# EAGLE design wifi-power (EAGLE 7.4.0)
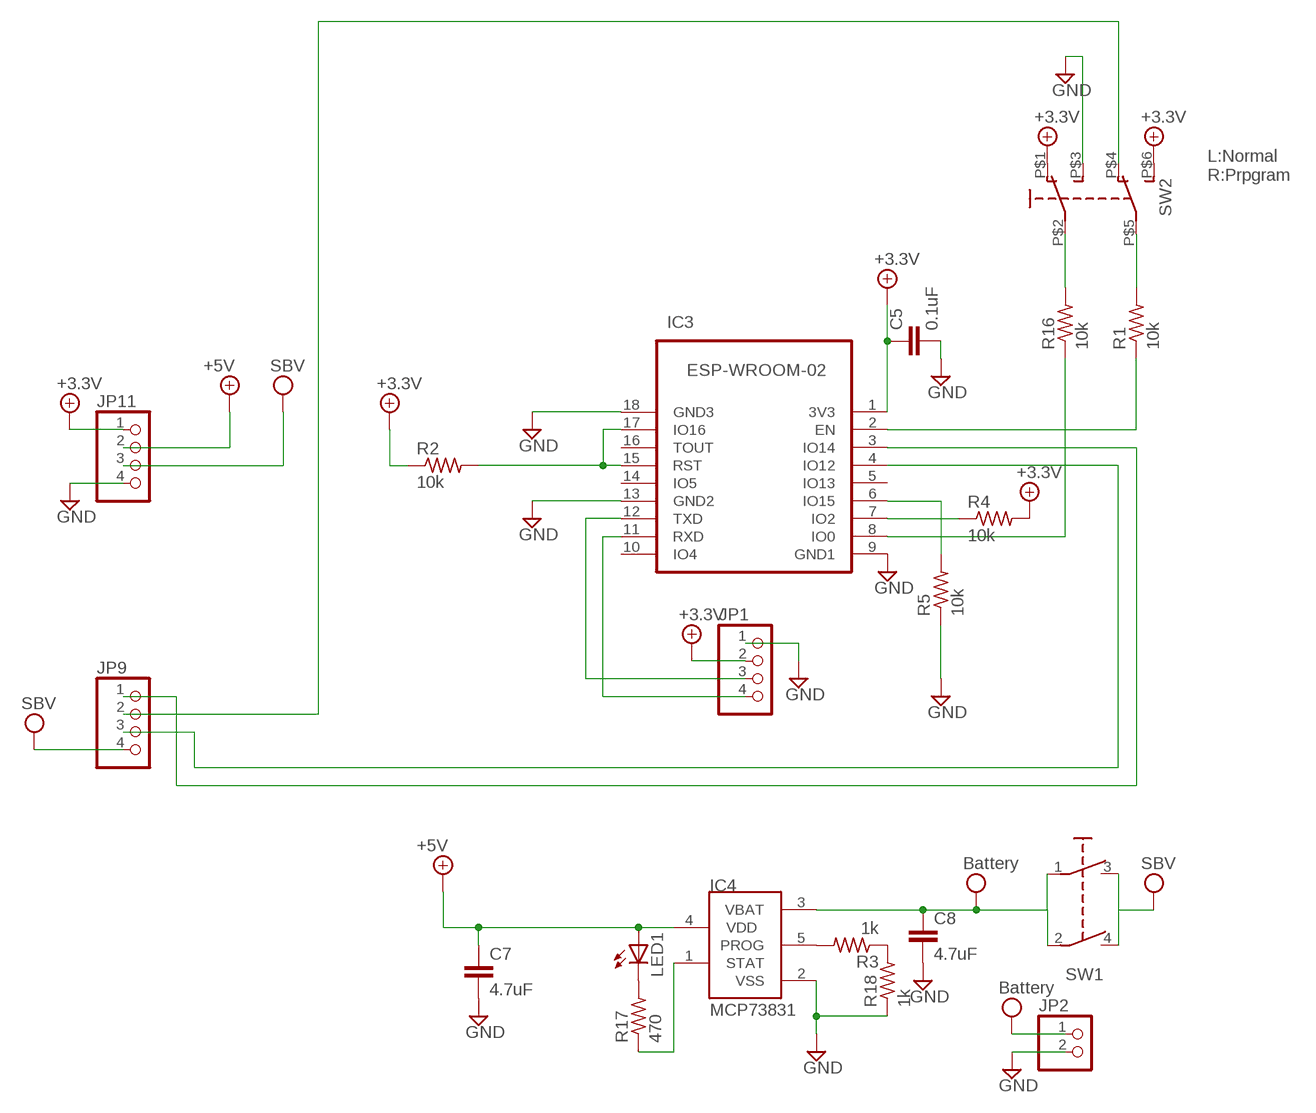
[diagram p0: schematic, sheet 1]

## Parts
C5  0.1uF  C-EUC0603K  [C0603K]
C7  4.7uF  C-EUC0603K  [C0603K]
C8  4.7uF  C-EUC0603K  [C0603K]
IC3  ESP-WROOM-02  ESP-WROOM-02FRONT-FACE  [FRONT-FACE]
IC4  MCP73831  [SOT23-5L]
JP1  PINHD-1X4  [1X04]
JP2  PINHD-1X2  [1X02]
JP9  PINHD-1X4  [1X04]
JP11  PINHD-1X4  [1X04]
LED1  LG_T679-E1F1-1  [PLCC2]
R1  10k  R-US_M0805  [M0805]
R2  10k  R-US_M0805  [M0805]
R3  1k  R-US_MELF0102R  [MINI_MELF-0102R]
R4  10k  R-US_M0805  [M0805]
R5  10k  R-US_M0805  [M0805]
R16  10k  R-US_M0805  [M0805]
R17  470  R-US_M0805  [M0805]
R18  1k  R-US_MELF0102R  [MINI_MELF-0102R]
SW1  2X1S-SIDE-0.1INCH  [2X1SIDE-0.1INCH]
SW2  MSS-22C02  [MSS-22C02]

## Nets
+3.3V: C5.1 IC3.1(3V3) JP1.2 JP11.1 R2.1 R4.2 SW2.P$1(O) SW2.P$6(S1)
+5V/2: C7.1 IC4.4(VDD) JP11.2 LED1.A ; supply symbol labelled +5V
GND: C5.2 C7.2 C8.2 IC3.9(GND1) IC3.13(GND2) IC3.18(GND3) IC4.2(VSS) JP1.1 JP2.2 JP11.4 R5.1 R18.1 SW2.P$3(S)
N$2: IC3.11(RXD) JP1.4
N$3: IC3.12(TXD) JP1.3
N$4: IC3.2(EN) R1.1
N$5: IC3.15(RST) IC3.17(IO16) R2.2
N$6: IC3.7(IO2) R4.1
N$7: IC3.8(IO0) R16.1
N$8: IC3.6(IO15) R5.2
N$9: IC4.5(PROG) R3.2
N$10: R3.1 R18.2
N$11: IC3.4(IO12) JP9.3
N$16: LED1.C R17.2
N$19: JP9.2 SW2.P$4(O1)
N$20: IC4.1(STAT) R17.1
N$49: R16.2 SW2.P$2(P)
N$56: R1.2 SW2.P$5(P1)
N$58: IC3.3(IO14) JP9.1
VCC: C8.1 IC4.3(VBAT) JP2.1 SW1.1(P) SW1.2(P1) ; supply symbol labelled Battery
VPP: JP9.4 JP11.3 SW1.3(S) SW1.4(S1) ; supply symbol labelled SBV
Unconnected: IC3.5(IO13) IC3.10(IO4) IC3.14(IO5) IC3.16(TOUT)

## Notes on the sheet
- L:Normal
  R:Prpgram

## Library data of the parts
C5 C7 C8 = rcl:C-EU: CAPACITOR, European symbol
IC3 = esp-wroom-02:ESP-WROOM-02: WiFi module - ESP-WROOM-02
IC4 = microchip-update-2:MCP73831: Miniature Single-Cell, Fully Integrated Li-Ion, Li-Polymer Charge Management Controllers
JP1 JP9 JP11 = pinhead:PINHD-1X4: PIN HEADER
JP2 = pinhead:PINHD-1X2: PIN HEADER
LED1 = led:*_T679-?-1: LC TOPLED® Low Current LED Source: http://catalog.osram-os.com .. LG_LS_LY_T679_OBS.pdf; COLOR: green
R1-R5 R16-R18 = rcl:R-US_: RESISTOR, American symbol
SW1 = switch-custom:2X1S-SIDE-0.1INCH
SW2 = switch-custom:MSS-22C02: See-Plus MSS-22C02 2回路2接点 超小型スライドスイッチ http://www.sengoku.co.jp/mod/sgk_cart/detail.php?code=EEHD-4J3U#

## Board
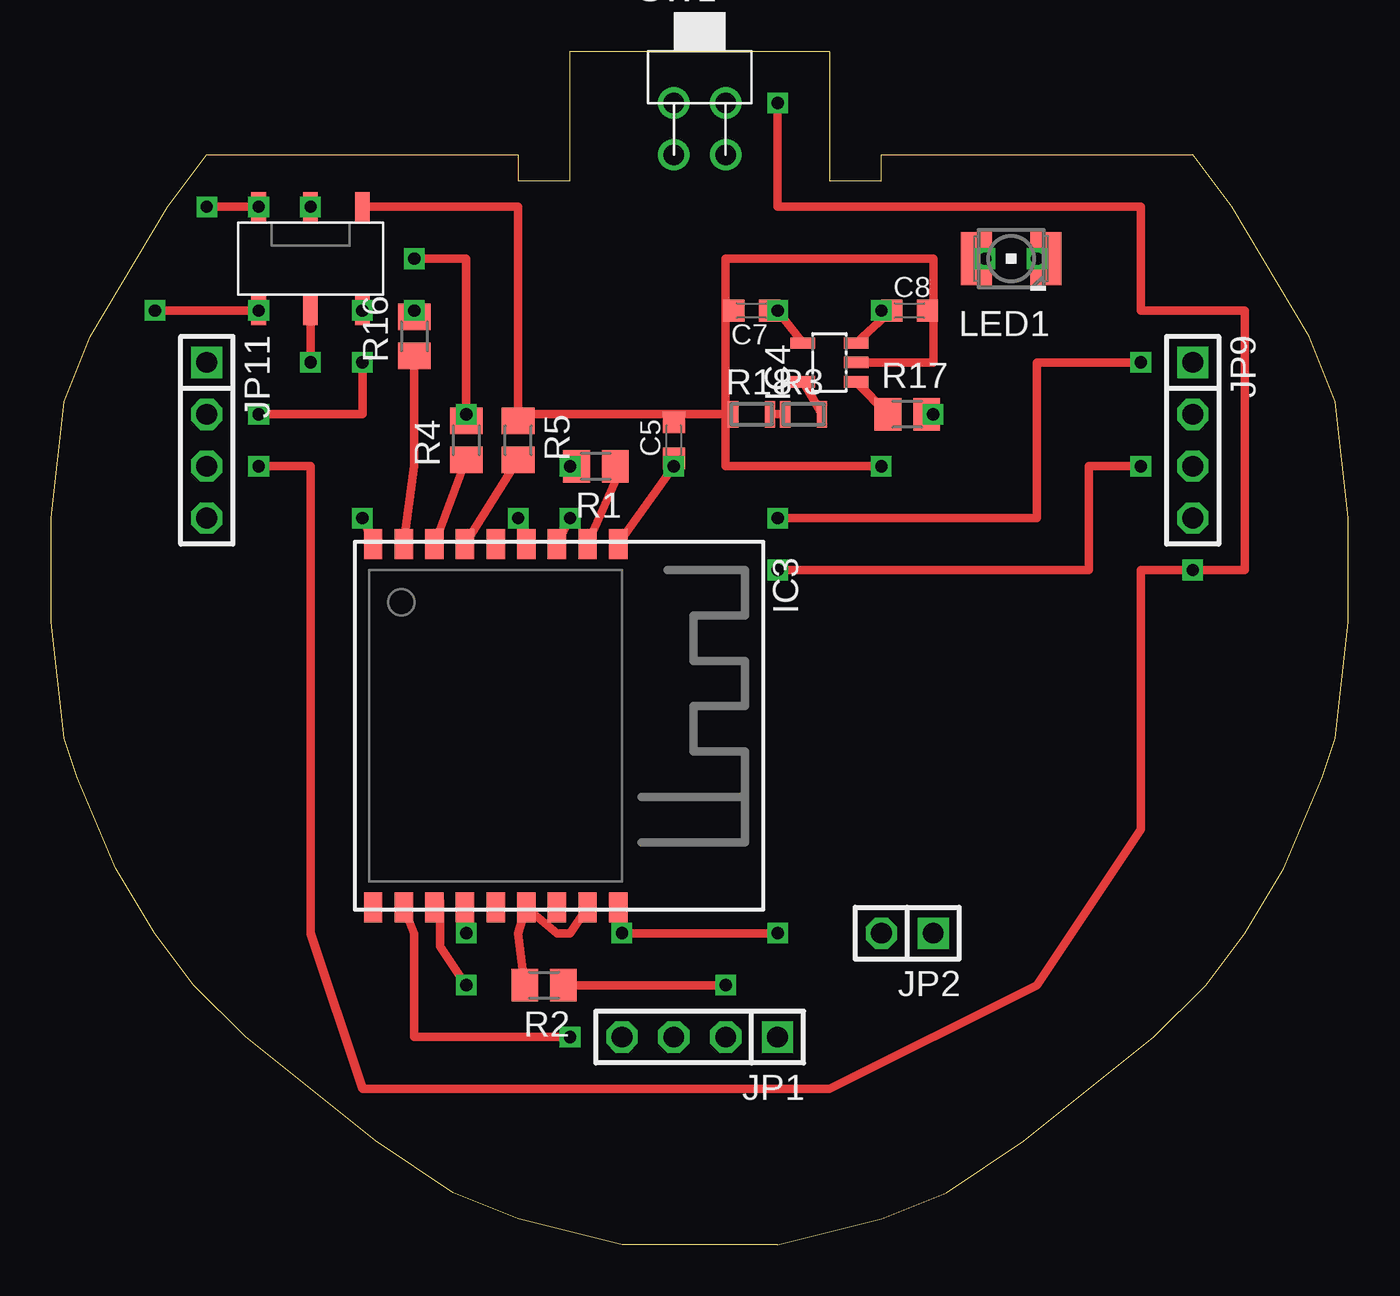
[diagram p1: board, top side]
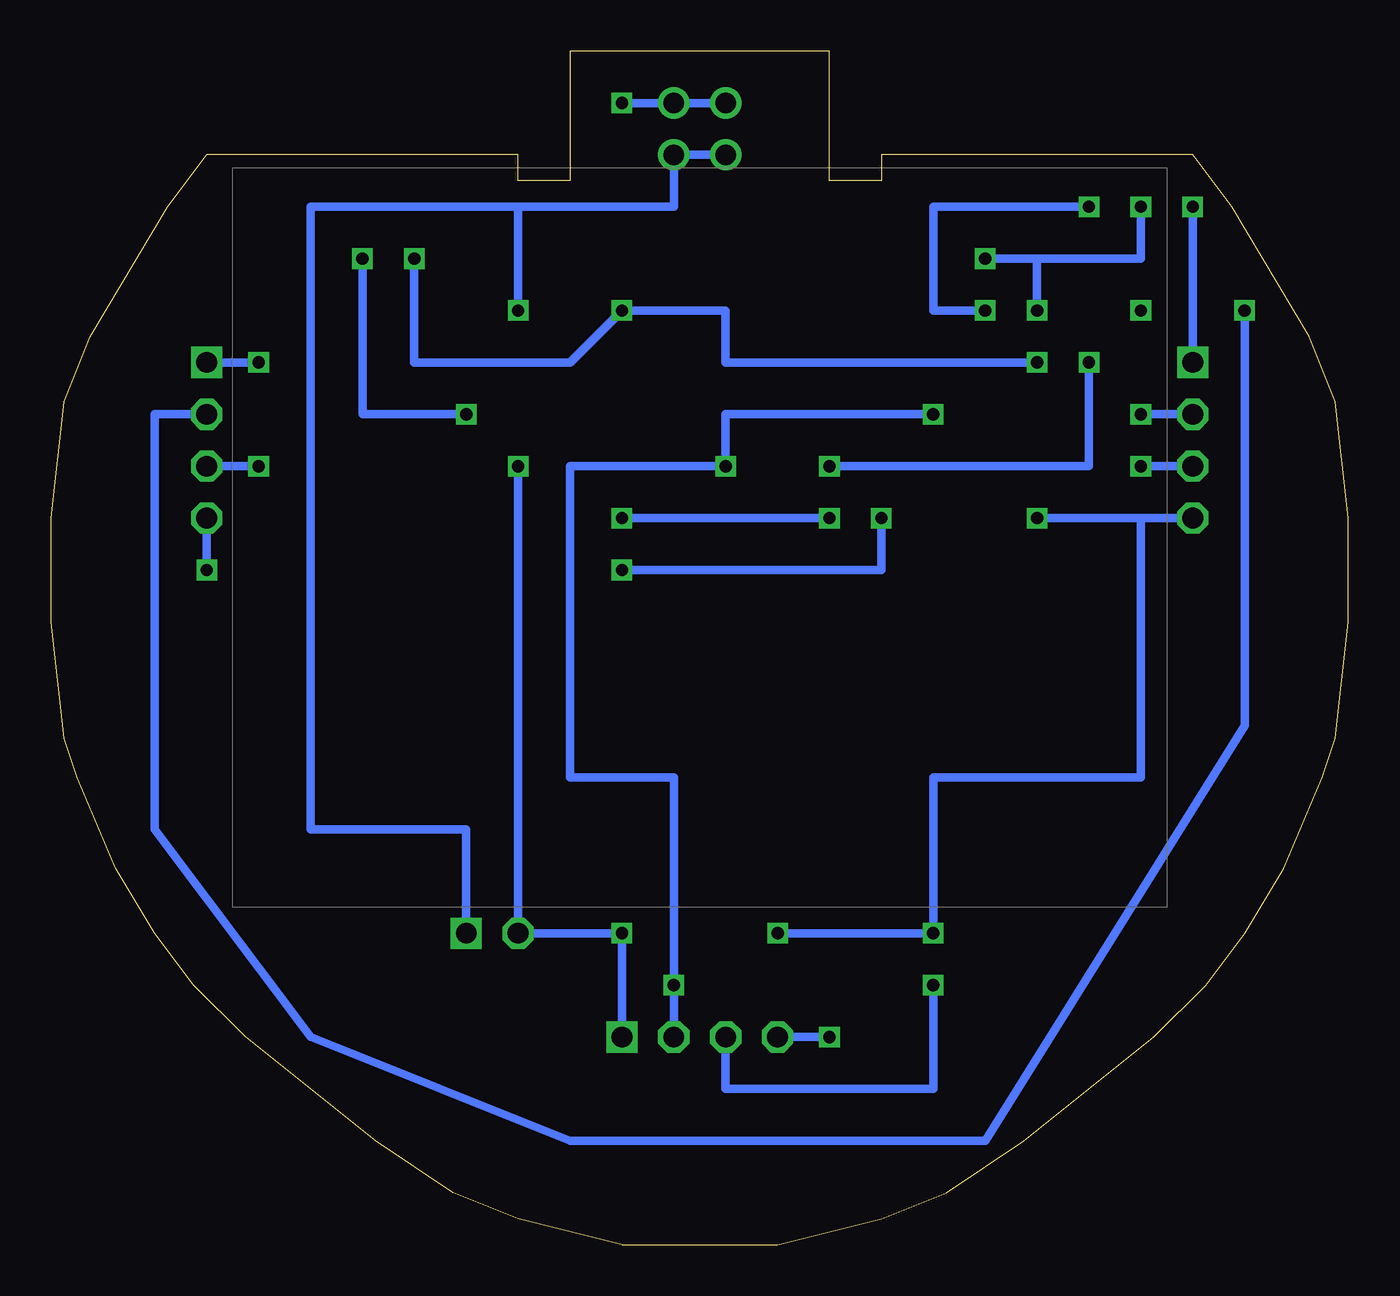
[diagram p2: board, bottom side, seen from below]

Size 63.5 x 58.42 mm. Coordinates in mm from the lower left corner, seen from the top.
Outline: 35.56,0 40.64,1.27 43.81,2.54 47.62,5.08 53.98,10.16 56.52,12.7 58.42,15.24 60.33,18.41 62.23,22.86 62.87,24.77 63.5,30.48 63.5,35.56 62.87,41.27 61.6,44.45 57.79,50.8 55.88,53.34 40.64,53.34 40.64,52.07 38.1,52.07 38.1,58.42 25.4,58.42 25.4,52.07 22.86,52.07 22.86,53.34 7.62,53.34 5.72,50.8 1.91,44.45 0.63,41.27 0,35.56 0,30.48 0.63,24.77 1.27,22.86 3.17,18.41 5.08,15.24 6.99,12.7 9.52,10.16 15.88,5.08 19.69,2.54 22.86,1.27 27.94,0 35.56,0
Copper layers (1*16): Top 0.035mm / dielectric 1.5mm / Bottom 0.035mm
Design rules "default *": minimum track width 10mil, minimum drill 23.5mil, track to track 8mil, track to pad 8mil, pad to pad 8mil, via to via 8mil, smd to smd 8mil, copper to edge 40mil, drill to drill 8mil, minimum pad ring 10mil, minimum via ring 8mil, stop-mask expansion 4mil, vias tented up to drill 0mil, thermal gap 10mil
tRestrict: area 38.1,12.7 to 45.7,30.5

### Footprints (pad centres in the part's own frame; a part is rotated, then mirrored left to right if it is on the bottom)
C0603K = smd 1.05 x 1.08: 1 -0.875,0; 2 0.875,0
FRONT-FACE = smd 1.485 x 0.9: 1 -8.893,4.9; 2 -8.893,3.4; 3 -8.893,1.9; 4 -8.893,0.4; 5 -8.893,-1.1; 6 -8.893,-2.6; 7 -8.893,-4.1; 8 -8.893,-5.6; 9 -8.893,-7.1; 10 8.893,-7.1; 11 8.893,-5.6; 12 8.893,-4.1; 13 8.893,-2.6; 14 8.893,-1.1; 15 8.893,0.4; 16 8.893,1.9; 17 8.893,3.4; 18 8.893,4.9
SOT23-5L = smd 0.55 x 1.2: 1 -0.95,-1.3; 2 0,-1.3; 3 0.95,-1.3; 4 0.95,1.3; 5 -0.95,1.3
1X04 = drill 1.016 square: 1 -3.81,0 | drill 1.016 octagon: 2 -1.27,0; 3 1.27,0; 4 3.81,0
1X02 = drill 1.016 square: 1 -1.27,0 | drill 1.016 octagon: 2 1.27,0
PLCC2 = smd 2.6 x 1.5: A 0,1.7; C 0,-1.7
M0805 = smd 1.3 x 1.6: 1 -0.95,0; 2 0.95,0
MINI_MELF-0102R = smd 0.5 x 1.3: 1 -0.9,0; 2 0.9,0
2X1SIDE-0.1INCH = drill 1.016: 1 2.54,-2.54; 2 0,-2.54; 3 2.54,0; 4 0,0
MSS-22C02 = smd 0.711 x 1.422: P$1 -2.54,2.54; P$2 0,2.54; P$3 2.54,2.54; P$4 -2.54,-2.54; P$5 0,-2.54; P$6 2.54,-2.54

### Placement (x,y rotation side)
C5  30.48,39.37 90 top
C7  34.29,45.72 180 top
C8  42.02,45.72 0 top
IC3  22.86,25.4 270 top
IC4  38.1,43.18 90 top
JP1  31.75,10.16 180 top
JP2  41.91,15.24 180 top
JP9  55.88,39.37 270 top
JP11  7.62,39.37 270 top
LED1  46.99,48.26 90 top
R1  26.67,38.1 180 top
R2  24.13,12.7 180 top
R3  36.83,40.64 0 top
R4  20.32,39.37 90 top
R5  22.86,39.37 270 top
R16  17.78,44.45 90 top
R17  41.91,40.64 0 top
R18  34.29,40.64 0 top
SW1  30.48,55.88 0 top
SW2  12.7,48.26 0 top

### Tracks (layer width: path | path; a pad name or v marks a point on that pad's centre or on a via)
+3.3V  (via drill 0.6)
  Top 0.406: v33.02,12.7 R2.1 | IC3.1 v30.48,38.1 C5.1 | v17.78,48.26 20.32,48.26 v20.32,40.64 R4.2 | v7.62,50.8 SW2.P$1
  Bottom 0.406: JP1.2 v33.02,12.7 33.02,22.86 38.1,22.86 38.1,38.1 v30.48,38.1 30.48,40.64 v20.32,40.64 | JP11.1 v7.62,50.8 | SW2.P$1 10.16,48.26 15.24,48.26 | SW2.P$6 15.24,48.26 | 15.24,48.26 v17.78,48.26
  other vias: 10.16,50.8 15.24,45.72
+5V/2  (via drill 0.6)
  Top 0.406: v45.72,48.26 LED1.A | v10.16,40.64 15.24,40.64 v15.24,43.18 | IC4.4 v35.56,45.72 C7.1
  Bottom 0.406: v45.72,48.26 45.72,43.18 38.1,43.18 v35.56,45.72 30.48,45.72 30.48,43.18 v15.24,43.18 | JP11.2 v10.16,40.64
GND  (via drill 0.6)
  Top 0.406: IC3.18 v27.94,15.24 v35.56,15.24 | IC3.13 v20.32,15.24 | IC3.9 v15.24,35.56 | SW2.P$3 22.86,50.8 22.86,40.64 | IC4.2 43.18,43.18 43.18,45.72 | 33.02,45.72 33.02,48.26 43.18,48.26 43.18,45.72 | 43.18,45.72 C8.2 | C7.2 33.02,45.72 | 33.02,45.72 33.02,40.64 | 33.02,40.64 30.48,40.64 | 30.48,40.64 C5.2 | v40.64,38.1 33.02,38.1 33.02,40.64 | 30.48,40.64 22.86,40.64 | 22.86,40.64 R5.1 | R18.1 33.02,40.64
  Bottom 0.406: JP1.1 v35.56,15.24 JP2.2 v40.64,38.1 | v27.94,15.24 v20.32,15.24 20.32,22.86 10.16,22.86 10.16,35.56 | 10.16,35.56 v15.24,35.56 | JP11.4 10.16,35.56
N$2  (via drill 0.6)
  Top 0.406: IC3.11 17.78,15.24 17.78,10.16 v25.4,10.16
  Bottom 0.406: v25.4,10.16 JP1.4
N$3  (via drill 0.6)
  Top 0.406: IC3.12 19.05,16.83 19.05,14.61 v20.32,12.7
  Bottom 0.406: v20.32,12.7 20.32,7.62 30.48,7.62 JP1.3
N$4
  Top 0.406: IC3.2 27.94,38.1 R1.1
N$5
  Top 0.406: R2.2 22.86,15.24 IC3.15 24.77,15.24 25.4,15.24 IC3.17
N$6
  Top 0.406: IC3.7 R4.1
N$7
  Top 0.406: IC3.8 17.78,38.1 R16.1
N$8
  Top 0.406: IC3.6 R5.2
N$9
  Top 0.406: IC4.5 R3.2
N$10
  Top 0.406: R18.2 R3.1
N$11  (via drill 0.6)
  Top 0.406: IC3.4 v22.86,35.56 | v35.56,33.02 50.8,33.02 50.8,38.1 v53.34,38.1
  Bottom 0.406: v22.86,35.56 22.86,33.02 v35.56,33.02 | JP9.3 v53.34,38.1
N$16  (via drill 0.6)
  Top 0.406: R17.2 v43.18,40.64 | v48.26,48.26 LED1.C
  Bottom 0.406: v43.18,40.64 48.26,40.64 v48.26,48.26
N$19  (via drill 0.6)
  Top 0.406: SW2.P$4 v5.08,45.72
  Bottom 0.406: v5.08,45.72 5.08,25.4 17.78,5.08 38.1,5.08 50.8,10.16 58.42,20.32 58.42,40.64 JP9.2
  other vias: 10.16,45.72
N$20
  Top 0.406: IC4.1 R17.1
N$49  (via drill 0.6)
  Top 0.406: v17.78,45.72 R16.2
  Bottom 0.406: SW2.P$2 20.32,50.8 20.32,45.72 v17.78,45.72
  other vias: 12.7,50.8
N$56  (via drill 0.6)
  Top 0.406: SW2.P$5 v12.7,43.18 | R1.2 v25.4,38.1
  Bottom 0.406: v12.7,43.18 12.7,38.1 v25.4,38.1
N$58  (via drill 0.6)
  Top 0.406: IC3.3 v25.4,35.56 | v35.56,35.56 48.26,35.56 48.26,43.18 v53.34,43.18
  Bottom 0.406: v25.4,35.56 v35.56,35.56 | v53.34,43.18 JP9.1
VCC  (via drill 0.6)
  Top 0.406: v40.64,45.72 C8.1 IC4.3
  Bottom 0.406: JP2.1 43.18,20.32 50.8,20.32 50.8,50.8 40.64,50.8 | 40.64,50.8 33.02,50.8 SW1.1 SW1.2 | 40.64,50.8 v40.64,45.72
VPP  (via drill 0.6)
  Top 0.406: v35.56,55.88 35.56,50.8 53.34,50.8 53.34,45.72 58.42,45.72 58.42,33.02 v55.88,33.02 53.34,33.02 53.34,20.32 48.26,12.7 38.1,7.62 15.24,7.62 12.7,15.24 12.7,38.1 v10.16,38.1
  Bottom 0.406: SW1.4 SW1.3 v35.56,55.88 | JP11.3 v10.16,38.1 | JP9.4 v55.88,33.02

### Text on the board
Document: R:Program / L:Normal